# Altium schematic sheet Boost_Driver.SchDoc
size A4
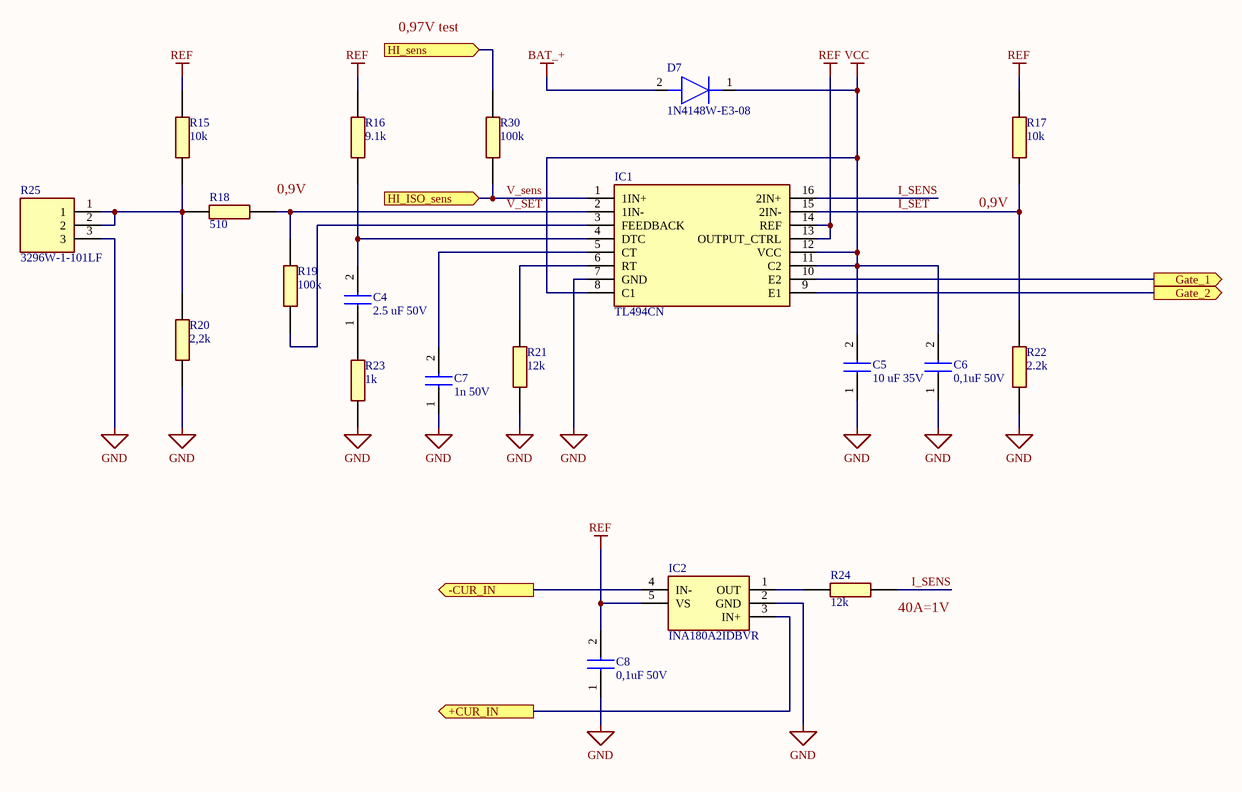
[diagram p0: Boost_Driver.SchDoc]

## Parts
C4  2.5 uF 50V  [CAPC2012X90N]
C5  10 uF 35V  [CAPC2012X90N]
C6  0,1uF 50V  [CAPC2012X90N]
C7  1n 50V  [CAPC2012X90N]
C8  0,1uF 50V  [CAPC2012X90N]
D7  1N4148W-E3-08  [SOD3716X135N]
IC1  TL494CN  [DIP794W53P254L1930H508Q16N]
IC2  INA180A2IDBVR  [SOT95P280X145-5N]
R15  10k  [RESC2013X65N]
R16  9.1k  [RESC2013X65N]
R17  10k  [RESC2013X65N]
R18  510  [RESC2013X65N]
R19  100k  [RESC2013X65N]
R20  2,2k  [RESC2013X65N]
R21  12k  [RESC2013X65N]
R22  2.2k  [RESC2013X65N]
R23  1k  [RESC2013X65N]
R24  12k  [RESC2013X65N]
R25  3296W-1-101LF  [3296W-1]
R30  100k  [RESC2013X65N]

## Ports
+CUR_IN (out), -CUR_IN (out), Gate_1 (out), Gate_2 (out), HI_ISO_sens (in), HI_sens (in)

## Nets
BAT_+: D7.2(A)
GND: C5.1 C6.1 C7.1 C8.1 IC1.7(GND) IC2.2(GND) R20.1 R21.1 R22.1 R23.1 R25.3
REF: C8.2 IC1.13(OUTPUT_CTRL) IC1.14(REF) IC2.5(VS) R15.2 R16.2 R17.2
VCC: C5.2 C6.2 D7.1(K) IC1.8(C1) IC1.11(C2) IC1.12(VCC)
+CUR_IN: IC2.3(IN+) ; port +CUR_IN
-CUR_IN: IC2.4(IN-) ; port -CUR_IN
Gate_1: IC1.10(E2) ; port Gate_1
Gate_2: IC1.9(E1) ; port Gate_2
HI_sens: R30.1 ; port HI_sens
I_SENS: IC1.16(2IN+) R24.1
I_SET: IC1.15(2IN-) R17.1 R22.2
V_sens: IC1.1(1IN+) R30.2 ; port HI_ISO_sens
V_SET: IC1.2(1IN-) R18.1 R19.1
NetC4_1: C4.1 R23.2
NetC4_2: C4.2 IC1.4(DTC) R16.1
NetC7_2: C7.2 IC1.5(CT)
NetIC1_3: IC1.3(FEEDBACK) R19.2
NetIC1_6: IC1.6(RT) R21.2
NetIC2_1: IC2.1(OUT) R24.2
NetR15_1: R15.1 R18.2 R20.2 R25.1 R25.2

## Notes on the sheet
- 0,97V test
- (near R18) 0,9V
- (near R17) 0,9V
- (near R24) 40A=1V

## Library data of the parts
C4-C8 = MCMT21N470F250CT: Capacitor; Height: 0.9mm
D7 = 1N4148W-E3-08: Diode; Manufacturer_Name: Vishay; Datasheet Link: http://www.vishay.com/docs/85748/1n4148w.pdf; Height: 1.35mm; Manufacturer_Part_Number: 1N4148W-E3-08; Mouser Part Number: 78-1N4148W-E3-08; Mouser Price/Stock: https://www.mouser.co.uk/ProductDetail/Vishay-Semiconductors/1N4148W-E3-08?qs=bTzheeSci6TVjpxfjjRVMw%3D%3D; Arrow Part Number: 1N4148W-E3-08; Arrow Price/Stock: https://www.arrow.com/en/products/1n4148w-e3-08/vishay?region=nac
IC1 = TL494CN: Integrated Circuit; Manufacturer_Name: Texas Instruments; Datasheet Link: http://www.ti.com/lit/gpn/tl494; Height: 5.08mm; Manufacturer_Part_Number: TL494CN; Mouser Part Number: 595-TL494CN; Mouser Price/Stock: https://www.mouser.co.uk/ProductDetail/Texas-Instruments/TL494CN?qs=N6WZOzgtpqWAYQVxthNGyw%3D%3D; Arrow Part Number: TL494CN; Arrow Price/Stock: https://www.arrow.com/en/products/tl494cn/texas-instruments?region=nac
IC2 = INA180A2IDBVR: Integrated Circuit; Manufacturer_Name: Texas Instruments; Datasheet Link: http://www.ti.com/lit/ds/symlink/ina180.pdf; Height: 1.45mm; Manufacturer_Part_Number: INA180A2IDBVR; Mouser Part Number: 595-INA180A2IDBVR; Mouser Price/Stock: https://www.mouser.co.uk/ProductDetail/Texas-Instruments/INA180A2IDBVR?qs=5aG0NVq1C4wYcJfa99BoHg%3D%3D; Arrow Part Number: INA180A2IDBVR; Arrow Price/Stock: https://www.arrow.com/en/products/ina180a2idbvr/texas-instruments?region=nac
R15-R24 R30 = ERJP06J822V: Resistor; Height: 0.7mm
R25 = 3296W-1-101LF: Resistor; Manufacturer_Name: Bourns; Datasheet Link: https://www.bourns.com/pdfs/3296.pdf; Manufacturer_Part_Number: 3296W-1-101LF; Mouser Part Number: 652-3296W-1-101LF; Mouser Price/Stock: https://www.mouser.co.uk/ProductDetail/Bourns/3296W-1-101LF?qs=UcU9LKO1dwEefwKxVJG4Jw%3D%3D; Arrow Part Number: 3296W-1-101LF; Arrow Price/Stock: https://www.arrow.com/en/products/3296w-1-101lf/bourns?region=europe